# Altium schematic sheet MCISO-S04-V00-Microcontroller.SchDoc: AMU Microcontroller
size A3; DrawnBy: Thomas Benedetti; DocumentNumber: 4; Revision: 01; SheetNumber: 2; SheetTotal: 9; Version: 01; Project: AMU 2020; PageSetup: Record=PageOptions|CenterHorizontal=True|CenterVertical=True|PrintScale=0.97|XCorrection=1.00|YCorrection=1.00|PrintKind=0|BorderSize=5000000|LeftOffset=0|BottomOffset=0|Orientation=2|PaperLength=1000|PaperWidth=1000|Scale=100|PaperSource=7|PrintQuality=-4|MediaType=1|DitherType=10|PaperKind=A4|PrintScaleMode=1
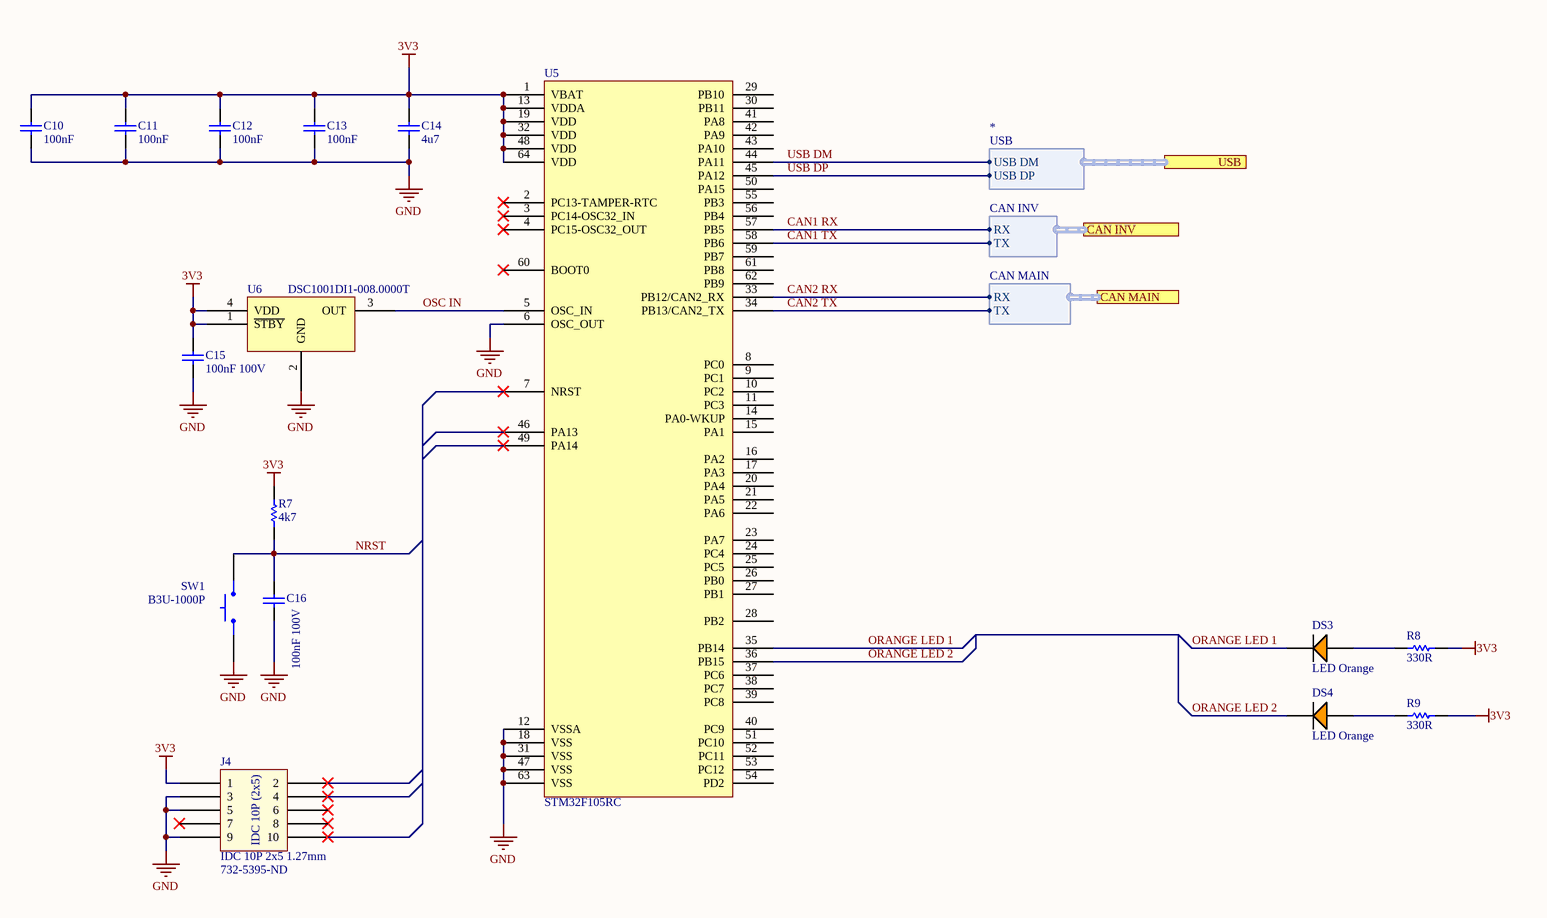
[diagram p0: MCISO-S04-V00-Microcontroller.SchDoc]

## Parts
C10  100nF  [Cap_Ceramic_0603]
C11  100nF  [Cap_Ceramic_0603]
C12  100nF  [Cap_Ceramic_0603]
C13  100nF  [Cap_Ceramic_0603]
C14  4u7  [Cap_Ceramic_0603]
C15  100nF 100V  [Cap_Ceramic_0603]
C16  100nF 100V  [Cap_Ceramic_0603]
DS3  LED Orange  [LED ORANGE 0603]
DS4  LED Orange  [LED ORANGE 0603]
J4  IDC 10P 2x5 1.27mm  [IDC 1.27MM 10P]
R7  4k7  [Res_ThinFilm_0603]
R8  330R  [Res_ThinFilm_0603]
R9  330R  [Res_ThinFilm_0603]
SW1  B3U-1000P  [BTN B3U-1000P]
U5  STM32F105RC  [STM32F105RC]
U6  DSC1001DI1-008.0000T  [DSC1001DI1-008.0000TCT-ND]

## Ports
CAN INV (harness CAN INV), CAN MAIN (harness CAN MAIN), USB (harness *)

## Harnesses
CAN MAIN: TX, RX
CAN INV: RX, TX
*: USB DM, USB DP

## Nets
3V3: C10.2 C11.2 C12.2 C13.2 C14.2 C15.2 J4.1 R7.2 R8.2 R9.2 U5.1(VBAT) U5.13(VDDA) U5.19(VDD) U5.32(VDD) U5.48(VDD) U5.64(VDD) U6.1(~{STBY}) U6.4(VDD)
GND: C10.1 C11.1 C12.1 C13.1 C14.1 C15.1 C16.1 J4.3 J4.5 J4.9 SW1.1 U5.6(OSC_OUT) U5.12(VSSA) U5.18(VSS) U5.31(VSS) U5.47(VSS) U5.63(VSS) U6.2(GND)
CAN1 RX: U5.57(PB5) ; port CAN INV.RX
CAN1 TX: U5.58(PB6) ; port CAN INV.TX
CAN2 RX: U5.33(PB12/CAN2_RX) ; port CAN MAIN.RX
CAN2 TX: U5.34(PB13/CAN2_TX) ; port CAN MAIN.TX
NRST: C16.2 R7.1 SW1.2
ORANGE LED 1: DS3.2(C) U5.35(PB14)
ORANGE LED 2: DS4.2(C) U5.36(PB15)
OSC IN: U5.5(OSC_IN) U6.3(OUT)
USB DM: U5.44(PA11) ; port USB.USB DM
USB DP: U5.45(PA12) ; port USB.USB DP
NetDS3_1: DS3.1(A) R8.1
NetDS4_1: DS4.1(A) R9.1

Not connected (* = marked no-connect by the designer): J4 2* 4* 6* 7* 8* 10*; U5 2(PC13-TAMPER-RTC)* 3(PC14-OSC32_IN)* 4(PC15-OSC32_OUT)* 7(NRST)* 8(PC0) 9(PC1) 10(PC2) 11(PC3) 14(PA0-WKUP) 15(PA1) 16(PA2) 17(PA3) 20(PA4) 21(PA5) 22(PA6) 23(PA7) 24(PC4) 25(PC5) 26(PB0) 27(PB1) 28(PB2) 29(PB10) 30(PB11) 37(PC6) 38(PC7) 39(PC8) 40(PC9) 41(PA8) 42(PA9) 43(PA10) 46(PA13)* 49(PA14)* 50(PA15) 51(PC10) 52(PC11) 53(PC12) 54(PD2) 55(PB3) 56(PB4) 59(PB7) 60(BOOT0)* 61(PB8) 62(PB9)

## Notes on the sheet
- USB
- (near J4) 732-5395-ND
- Revision History:
- Sheet Title:
- Rev
- Date
- Description
- Project:
- Size:
- Drawn By:
- A3
- Number:
- Revision:
- Sheet
- Version:
- of
- QUT Motorsport
- O-120, Gardens Point
- 2 George Street
- Brisbane, QLD 4000
- Australia
- Print Date:
- Print Time:
- File Name:
- (in symbol IDC 10P 2x5 1.27mm) IDC 10P (2x5)

## Library data of the parts
C10-C13 = 100nF 50V 5% X7R 0603: Capacitor, Ceramic, SMD, 100nF, 50V, 5%, X7R, 0603
C14 = 4u7 50V 5% X7R 0603: Capacitor, Ceramic, SMD, 4u7, 50V, 5%, X7R, 0603
C15 C16 = 100nF 100V 5% X7R 0603: Capacitor, Ceramic, SMD, 100nF, 100V, 5%, X7R, 0603
DS3 DS4 = LED ORANGE 0603
R7 = 4k7 5% 0603: Resistor, SMD, 4k7, 0.1W, 5%, 0603
R8 R9 = 330R 5% 0603: Resistor, SMD, 330R, 0.1W, 5%, 0603
SW1 = BTN B3U-1000P: Omron B3U-1000P Ultra Miniture Switch; ComponentLink1Description: LCSC; ComponentLink1URL: https://lcsc.com/product-detail/Tactile-Switches_BRIGHT-TSA063G50-250_C294565.html
U5 = STM32F105RC: ARM® Cortex®-M3 STM32F1 Microcontroller IC 32-Bit 72MHz 256KB (256K x 8) FLASH 64-LQFP (10x10); ComponentLink1Description: Digikey; ComponentLink1URL: https://www.digikey.com.au/product-detail/en/stmicroelectronics/STM32F105RCT6TR/497-17397-1-ND/8024118; ComponentLink2Description: Datasheet; ComponentLink2URL: https://www.st.com/content/ccc/resource/technical/document/datasheet/e4/f3/1a/89/5a/02/46/ae/CD00220364.pdf/files/CD00220364.pdf/jcr:content/translations/en.CD00220364.pdf
U6 = DSC1001DI1-008.0000T: on 8MHz XO (Standard) CMOS Oscillator 1.8 ~ 3.3V Standby (Power Down) 4-SMD, No Lead